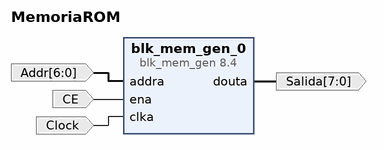
[diagram p0: block diagram of the top level]
# Vivado block design MemoriaROM, xc7s25csga324-2, Vivado 2023.2
create_bd_design MemoriaROM

create_bd_port -dir I -from 6 -to 0 -type data Addr
create_bd_port -dir I -type clk Clock
set_property -dict {CONFIG.FREQ_HZ 100000000} [get_bd_ports Clock]
create_bd_port -dir O -from 7 -to 0 -type data Salida
create_bd_port -dir I -type data CE

create_bd_cell -type ip -vlnv xilinx.com:ip:blk_mem_gen:8.4 blk_mem_gen_0
set_property -dict [list \
  CONFIG.Coe_File ../../../../../../MemoriaROM.coe \
  CONFIG.Enable_A Use_ENA_Pin \
  CONFIG.Load_Init_File true \
  CONFIG.Memory_Type Single_Port_ROM \
  CONFIG.Use_REGCEA_Pin false \
  CONFIG.Use_RSTA_Pin false \
  CONFIG.Write_Depth_A 127 \
  CONFIG.Write_Width_A 8 \
  CONFIG.use_bram_block Stand_Alone \
] [get_bd_cells blk_mem_gen_0]

# ---- connections ----

connect_bd_net [get_bd_ports Addr] [get_bd_pins blk_mem_gen_0/addra]
connect_bd_net [get_bd_ports CE] [get_bd_pins blk_mem_gen_0/ena]
connect_bd_net [get_bd_ports Clock] [get_bd_pins blk_mem_gen_0/clka]
connect_bd_net [get_bd_pins blk_mem_gen_0/douta] [get_bd_ports Salida]

validate_bd_design
save_bd_design
